# EAGLE design Aux Board V5 (EAGLE 9.2.0)
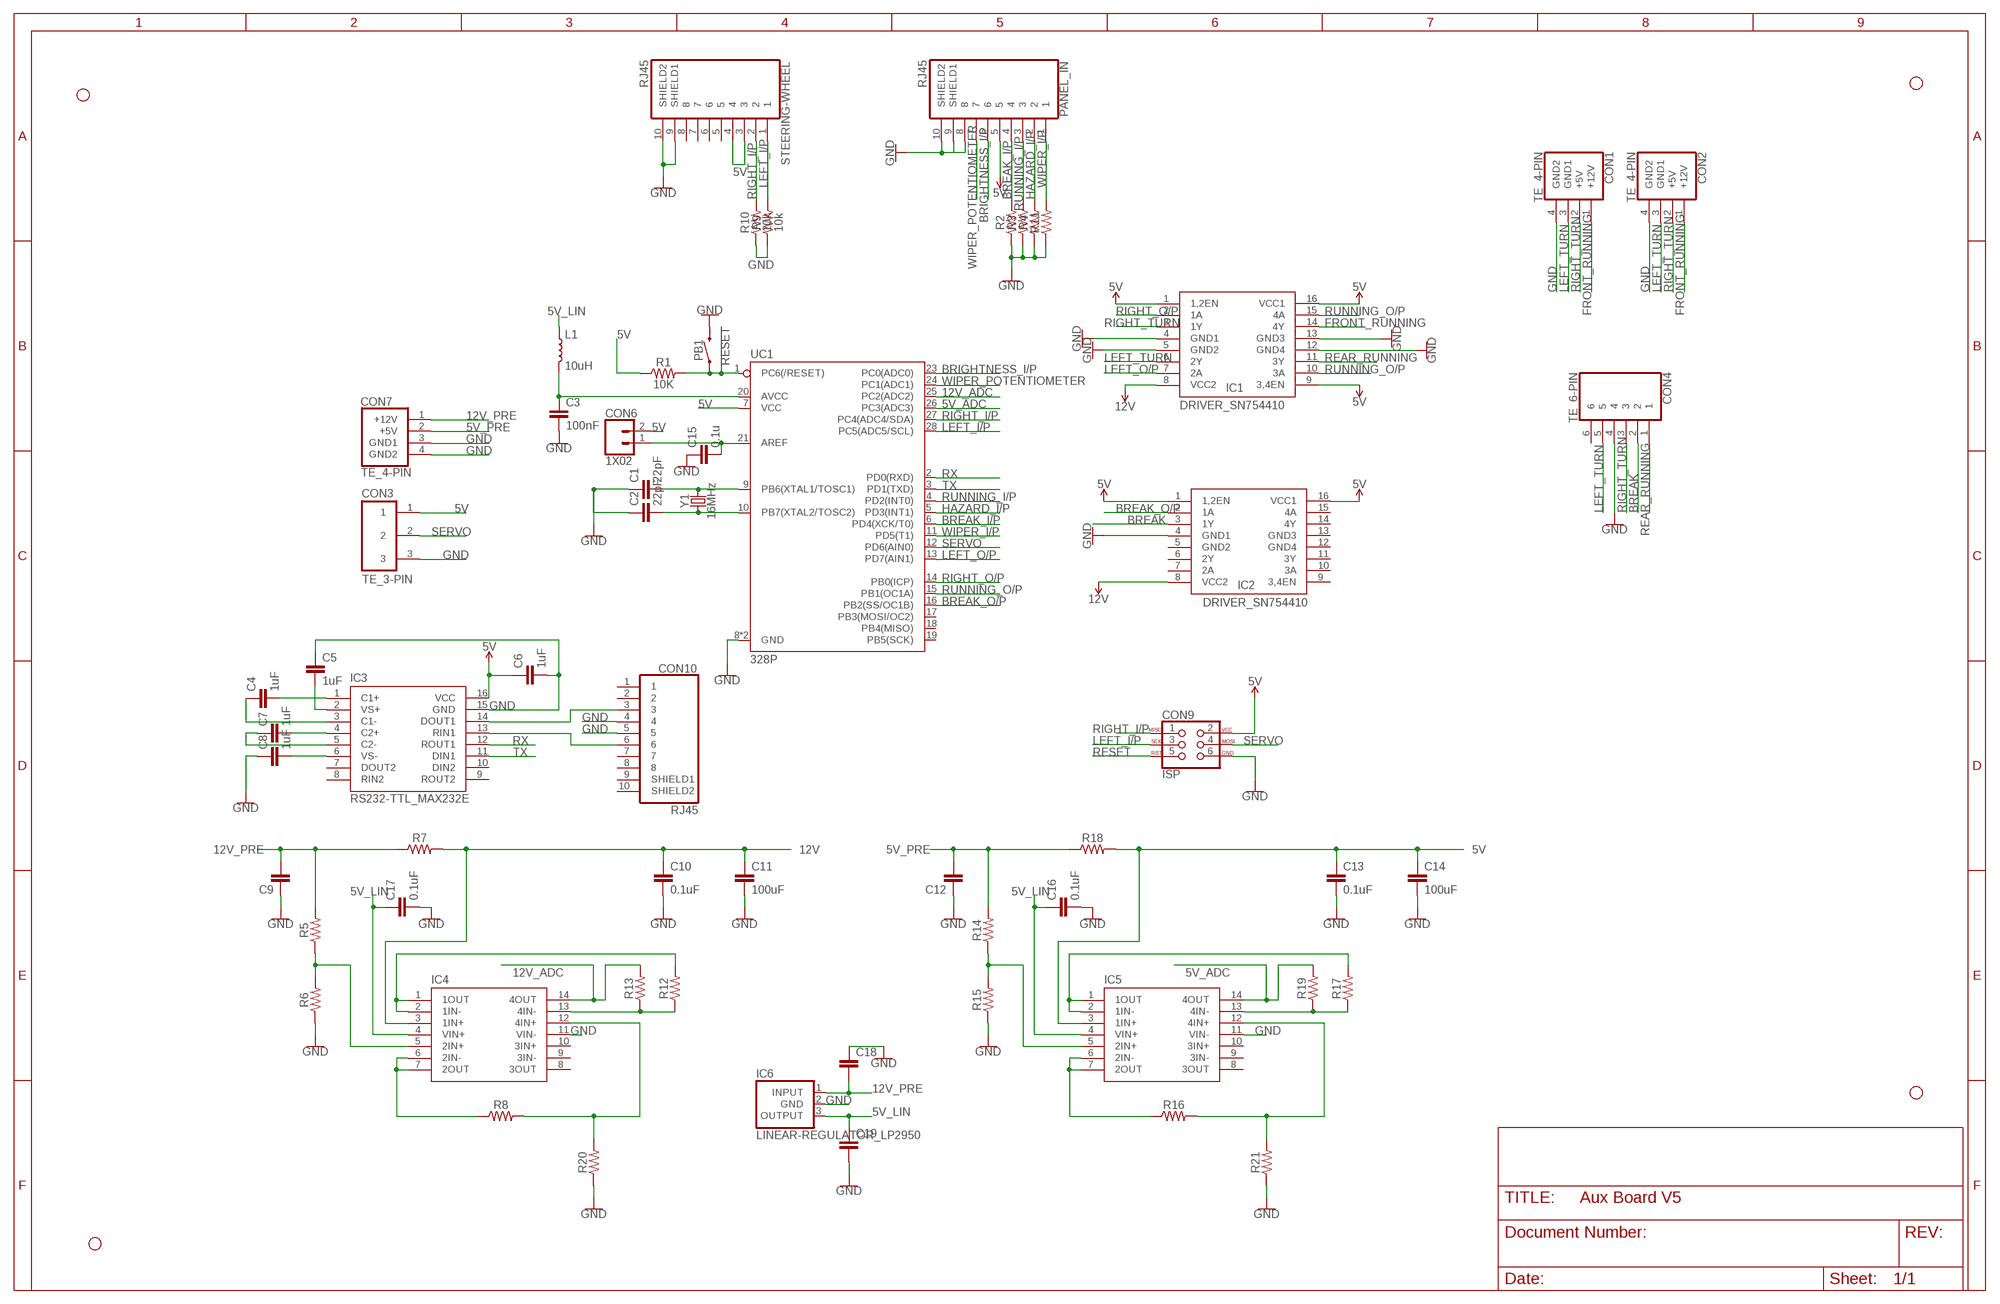
[diagram p0: schematic, sheet 1]

## Parts
C1  22pF  CAPACITOR_0805  [0805]
C2  22pF  CAPACITOR_0805  [0805]
C3  100nF  CAPACITOR_0805  [0805]
C4  1uF  CAPACITOR_0805  [0805]
C5  1uF  CAPACITOR_0805  [0805]
C6  1uF  CAPACITOR_0805  [0805]
C7  1uF  CAPACITOR_0805  [0805]
C8  1uF  CAPACITOR_0805  [0805]
C9  CAPACITOR_0805  [0805]
C10  0.1uF  CAPACITOR_0805  [0805]
C11  100uF  CAPACITOR_0805  [0805]
C12  CAPACITOR_0805  [0805]
C13  0.1uF  CAPACITOR_0805  [0805]
C14  100uF  CAPACITOR_0805  [0805]
C15  0.1u  CAPACITOR_0805  [0805]
C16  0.1uF  CAPACITOR_0805  [0805]
C17  0.1uF  CAPACITOR_0805  [0805]
C18  CAPACITOR_0805  [0805]
C19  CAPACITOR_0805  [0805]
CON1  TE_4-PIN  [TE_4-PIN]
CON2  TE_4-PIN  [TE_4-PIN]
CON3  TE_3-PIN  [TE_3-PIN]
CON4  TE_6-PIN  [TE_6-PIN]
CON6  1X02  [1X02]
CON7  TE_4-PIN  [TE_4-PIN]
CON9  ISP  [ISP_CONNECTOR]
CON10  RJ45  [RJ45]
H1  STAND-OFF  [STAND-OFF]
H2  STAND-OFF  [STAND-OFF]
H3  STAND-OFF  [STAND-OFF]
H4  STAND-OFF  [STAND-OFF]
IC1  DRIVER_SN754410  [DIP16]
IC2  DRIVER_SN754410  [DIP16]
IC3  RS232-TTL_MAX232E  [DIP16]
IC4  OP-AMP_QUAD  [DIP14]
IC5  OP-AMP_QUAD  [DIP14]
IC6  LINEAR-REGULATOR_LP2950  [TO92]
L1  10uH  INDUCTOR_0805  [0805]
PANEL_IN  RJ45  [RJ45]
PB1  PUSHBUTTON  [PUSHBUTTON]
R1  10K  RESISTOR_0805  [0805]
R2  RESISTOR_0805  [0805]
R3  RESISTOR_0805  [0805]
R4  RESISTOR_0805  [0805]
R5  RESISTOR_0805  [0805]
R6  RESISTOR_0805  [0805]
R7  RESISTOR_1210  [1210]
R8  RESISTOR_0805  [0805]
R9  10k  RESISTOR_0805  [0805]
R10  10k  RESISTOR_0805  [0805]
R11  RESISTOR_0805  [0805]
R12  RESISTOR_0805  [0805]
R13  RESISTOR_0805  [0805]
R14  RESISTOR_0805  [0805]
R15  RESISTOR_0805  [0805]
R16  RESISTOR_0805  [0805]
R17  RESISTOR_0805  [0805]
R18  RESISTOR_1210  [1210]
R19  RESISTOR_0805  [0805]
R20  RESISTOR_0805  [0805]
R21  RESISTOR_0805  [0805]
STEERING-WHEEL  RJ45  [RJ45]
UC1  328P  ATMEGA328P_DIP28  [DIP28]
Y1  16MHz  CRYSTAL-16MHZPTH-HC49US  [HC49US]

## Nets
5V: C6.1 C13.1 C14.1 C15.2 CON3.1 CON6.1 CON6.2 CON9.2 IC1.1(1,2EN) IC1.9(3,4EN) IC1.16(VCC1) IC2.1(1,2EN) IC2.16(VCC1) IC3.16(VCC) IC5.3(1IN+) PANEL_IN.5 R1.1 R18.2 STEERING-WHEEL.3 STEERING-WHEEL.4 UC1.7(VCC) UC1.21(AREF)
5V_ADC: IC5.14(4OUT) R19.2 UC1.26(PC3(ADC3))
5V_LIN: C16.1 C17.1 C19.1 IC4.4(VIN+) IC5.4(VIN+) IC6.3(OUTPUT) L1.1
5V_PRE: C12.2 CON7.2(+5V) R14.2 R18.1
12V: C10.1 C11.1 IC1.8(VCC2) IC2.8(VCC2) IC4.3(1IN+) R7.2
12V_ADC: IC4.14(4OUT) R13.2 UC1.25(PC2(ADC2))
12V_PRE: C9.2 C18.2 CON7.1(+12V) IC6.1(INPUT) R5.2 R7.1
BREAK: CON4.2 IC2.3(1Y)
BREAK_I/P: PANEL_IN.4 R2.2 UC1.6(PD4(XCK/T0))
BREAK_O/P: IC2.2(1A) UC1.16(PB2(SS/OC1B))
BRIGHTNESS_I/P: PANEL_IN.6 UC1.23(PC0(ADC0))
FRONT_RUNNING: CON1.1(+12V) CON2.1(+12V) IC1.14(4Y)
GND: C1.1 C2.1 C3.2 C5.1 C6.2 C8.1 C9.1 C10.2 C11.2 C12.1 C13.2 C14.2 C15.1 C16.2 C17.2 C18.1 C19.2 CON1.4(GND2) CON2.4(GND2) CON3.3 CON4.4 CON7.3(GND1) CON7.4(GND2) CON9.6 CON10.4 CON10.5 IC1.4(GND1) IC1.5(GND2) IC1.12(GND4) IC1.13(GND3) IC2.4(GND1) IC3.15(GND) IC4.11(VIN-) IC5.11(VIN-) IC6.2(GND) PANEL_IN.8 PANEL_IN.9(SHIELD1) PANEL_IN.10(SHIELD2) PB1.3 PB1.4 R2.1 R3.1 R4.1 R6.1 R9.1 R10.1 R11.1 R15.1 R20.1 R21.1 STEERING-WHEEL.9(SHIELD1) STEERING-WHEEL.10(SHIELD2) UC1.8(GND) UC1.22(GND)
HAZARD_I/P: PANEL_IN.2 R4.2 UC1.5(PD3(INT1))
LEFT_I/P: CON9.3 R9.2 STEERING-WHEEL.1 UC1.28(PC5(ADC5/SCL))
LEFT_O/P: IC1.7(2A) UC1.13(PD7(AIN1))
LEFT_TURN: CON1.3(GND1) CON2.3(GND1) CON4.5 IC1.6(2Y)
N$1: C4.2 IC3.1(C1+)
N$2: IC4.5(2IN+) R5.1 R6.2
N$3: C4.1 IC3.3(C1-)
N$4: C5.2 IC3.2(VS+)
N$5: IC4.6(2IN-) IC4.7(2OUT) R8.1
N$6: IC5.5(2IN+) R14.1 R15.2
N$7: IC4.1(1OUT) IC4.2(1IN-) R12.2
N$8: C1.2 UC1.9(PB6(XTAL1/TOSC1)) Y1.2
N$9: C2.2 UC1.10(PB7(XTAL2/TOSC2)) Y1.1
N$10: C7.2 IC3.4(C2+)
N$11: C7.1 IC3.5(C2-)
N$12: C8.2 IC3.6(VS-)
N$13: CON10.3 IC3.14(DOUT1)
N$14: CON10.6 IC3.13(RIN1)
N$15: IC4.13(4IN-) R12.1 R13.1
N$16: IC5.6(2IN-) IC5.7(2OUT) R16.1
N$17: IC5.1(1OUT) IC5.2(1IN-) R17.2
N$18: IC5.13(4IN-) R17.1 R19.1
N$19: C3.1 L1.2 UC1.20(AVCC)
N$20: IC4.12(4IN+) R8.2 R20.2
N$21: IC5.12(4IN+) R16.2 R21.2
REAR_RUNNING: CON4.1 IC1.11(3Y)
RESET: CON9.5 PB1.1 PB1.2 R1.2 UC1.1(PC6(/RESET))
RIGHT_I/P: CON9.1 R10.2 STEERING-WHEEL.2 UC1.27(PC4(ADC4/SDA))
RIGHT_O/P: IC1.2(1A) UC1.14(PB0(ICP))
RIGHT_TURN: CON1.2(+5V) CON2.2(+5V) CON4.3 IC1.3(1Y)
RUNNING_I/P: PANEL_IN.3 R3.2 UC1.4(PD2(INT0))
RUNNING_O/P: IC1.10(3A) IC1.15(4A) UC1.15(PB1(OC1A))
RX: IC3.12(ROUT1) UC1.2(PD0(RXD))
SERVO: CON3.2 CON9.4 UC1.12(PD6(AIN0))
TX: IC3.11(DIN1) UC1.3(PD1(TXD))
WIPER_I/P: PANEL_IN.1 R11.2 UC1.11(PD5(T1))
WIPER_POTENTIOMETER: PANEL_IN.7 UC1.24(PC1(ADC1))
Unconnected: CON4.6 CON10.1 CON10.2 CON10.7 CON10.8 CON10.9(SHIELD1) CON10.10(SHIELD2) IC2.5(GND2) IC2.6(2Y) IC2.7(2A) IC2.9(3,4EN) IC2.10(3A) IC2.11(3Y) IC2.12(GND4) IC2.13(GND3) IC2.14(4Y) IC2.15(4A) IC3.7(DOUT2) IC3.8(RIN2) IC3.9(ROUT2) IC3.10(DIN2) IC4.8(3OUT) IC4.9(3IN-) IC4.10(3IN+) IC5.8(3OUT) IC5.9(3IN-) IC5.10(3IN+) STEERING-WHEEL.5 STEERING-WHEEL.6 STEERING-WHEEL.7 STEERING-WHEEL.8 UC1.17(PB3(MOSI/OC2)) UC1.18(PB4(MISO)) UC1.19(PB5(SCK))

## Library data of the parts
C1-C19 = EcoCar-Passives:CAPACITOR_0805
CON1 CON2 CON7 = EcoCar-Connectors:TE_4-PIN: 4 Pin TE Mini-Universal MATE-N-LOK - Use for 12V and 5V connections Part Number: 1-770968-0 Digikey Part Number: A32474-ND Matching Plug: A25571-ND Matching Crimps: A100828CT-ND
CON3 = EcoCar-Connectors:TE_3-PIN: 3 Pin TE Mini-Universal MATE-N-LOK Part Number: 1-770967-0 Digikey Part Number: A32473-ND Matching Plug: A25588-ND Matching Crimps: A100828CT-ND
CON4 = EcoCar-Connectors:TE_6-PIN: 6 Pin TE Mini-Universal MATE-N-LOK Part Number: 1-770969-0 Digikey Part Number: A32475-ND Matching Plug: A97674-ND Matching Crimps: A100828CT-ND
CON6 = EcoCar-Connectors-2.54mm:1X02: 2.54mm (0.1") Header
CON9 = EcoCar-Microcontrollers:ISP: ISP Header Use for programming microcontrollers such as the 328P
CON10 PANEL_IN STEERING-WHEEL = EcoCar-Connectors:RJ45: RJ45 Connector - Use for signals and low power connections Unshielded Part Number: RJHSE-5080 Unshielded Digikey Part Number: RJHSE-5080-ND Shielded Part Number: RJHSE5E80 Shielded Digikey Part Number: RJHSE5E80-ND
H1-H4 = EcoCar-Miscellaneous:STAND-OFF: Stand Off Drill holes for mechanically mounting via screws, standoffs, etc. Note: Use the keepout ring to avoid running the screw head into surrounding components. Variant Overviews STAND-OFF - Mechanical footprint for a #4 phillips button head screw. STAND-OFF-TIGHT - Mechanical footprint for a #4 phillips button head screw, Example SparkFun Products Screw - Phillips Head (1/4", 4-40, 10 pack) <https://www.sparkfun.com/products/10453> (PRT-10453) Screw - Phillips Head (1/2", 4-40, 10 pack) <https://www.sparkfun.com/products/10452> (PRT-10452) Screw - Phillips Head (3/4", 4-40, 10 pack) <https://www.sparkfun.com/products/10451> (PRT-10451) Screw - Phillips Head (1", 4-40, 10 pack) <https://www.sparkfun.com/products/10450> (PRT-10450)
IC1 IC2 = EcoCar-Integrated-Circuits:DRIVER_SN754410: SN754410 Quadruple Half-H Driver Manufacturer: Texas Instruments Part Number: SN754410NE Digikey Part Number: 296-9911-5-ND
IC3 = EcoCar-Integrated-Circuits:RS232-TTL_MAX232E: Dual 5V TTL to RS-232 Converter Manufacturer: Texas Instruments Part Number: MAX232EIN Digikey Part Number: 296-27963-5-ND
IC4 IC5 = EcoCar-Integrated-Circuits:OP-AMP_QUAD: Quad Channel Op-Amp (Generic) Example Part: Manufacturer: Texas Instruments Part Number: TLV274IN Digikey Part Number: 296-14379-5-ND
IC6 = EcoCar-Integrated-Circuits:LINEAR-REGULATOR_LP2950: 5V Linear Regulator Manufacturer: Texas Instruments Part Number: LP2950-50LPRE3 Digikey Part Number: 296-20933-1-ND
L1 = EcoCar-Passives:INDUCTOR_0805
PB1 = EcoCar-Electromechanical:PUSHBUTTON: Pushbutton Manufacturer: TE Connectivity ALCOSWITCH Switches Part Number: 1825910-6 Digikey Part Number: 450-1650-ND
R1-R6 R8-R17 R19-R21 = EcoCar-Passives:RESISTOR_0805
R7 R18 = EcoCar-Passives:RESISTOR_1210
UC1 = EcoCar-Microcontrollers:ATMEGA328P_DIP28: ATmega328P Manufacturer: Microchip Part Number: ATMEGA328P-PU Digikey Part Number: ATMEGA328P-PU-ND; PROD_ID: IC-09136
Y1 = EcoCar-Microcontrollers:CRYSTAL-16MHZ: 16MHz Crystal Oscillator Manufacturer: TXC Part Number: 9B-16.000MBBK-B Digikey Part Number: 887-2015-ND; PROD_ID: XTAL-08181; SF_ID: COM-00536

## Board
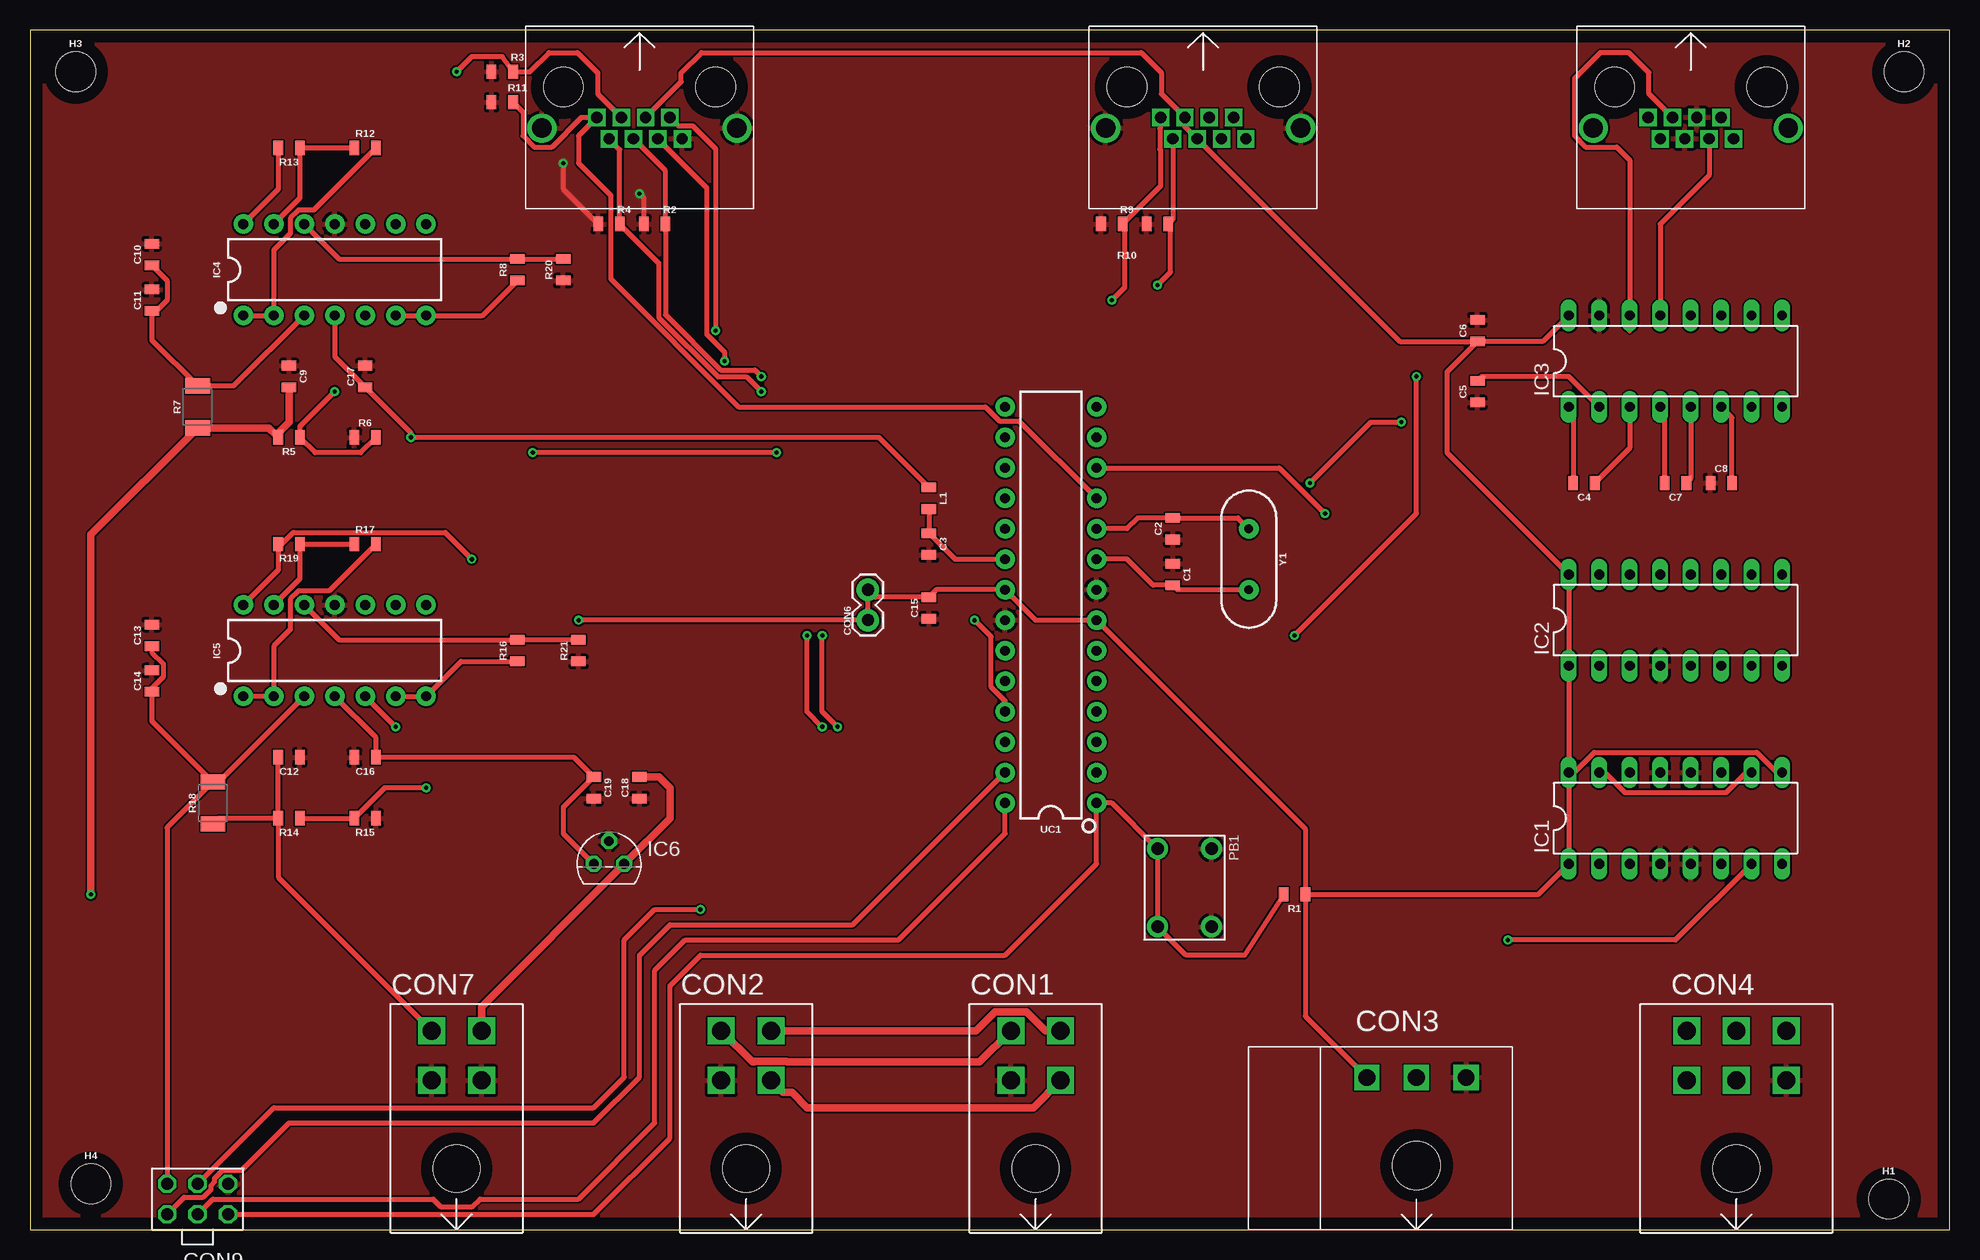
[diagram p1: board, top side]
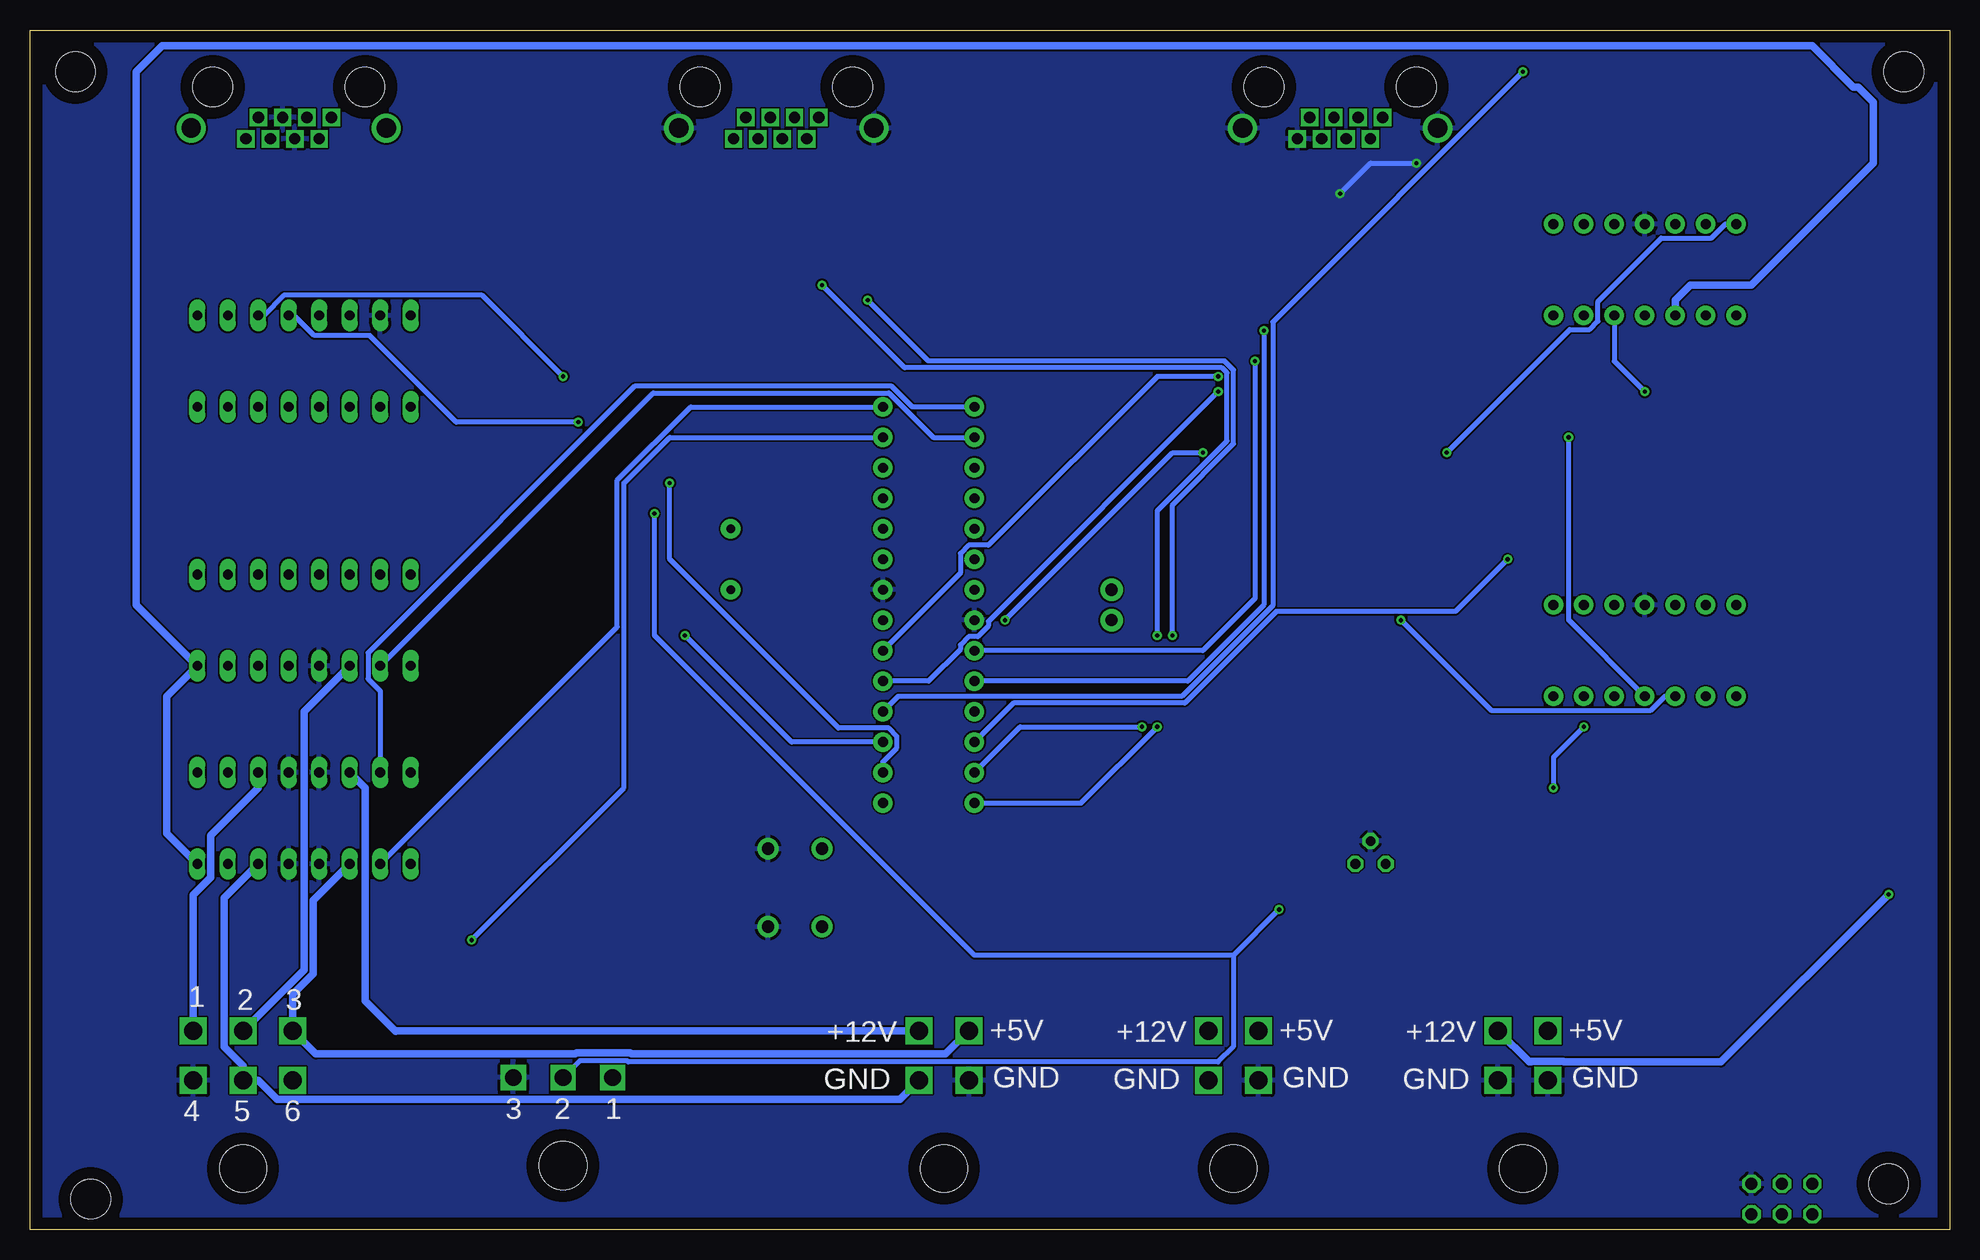
[diagram p2: board, bottom side, seen from below]

Size 160 x 100 mm. Coordinates in mm from the lower left corner, seen from the top.
Outline: 0,0 160,0 160,100 0,100 0,0
Copper layers (1*16): Top 0.035mm / dielectric 1.5mm / Bottom 0.035mm
Design rules "default": minimum track width 6mil, minimum drill 0.35mm, track to track 6mil, track to pad 6mil, pad to pad 6mil, via to via 6mil, smd to smd 6mil, copper to edge 40mil, drill to drill 6mil, minimum pad ring 10mil, minimum via ring 8mil, stop-mask expansion 4mil, vias tented up to drill 0mil, thermal gap 10mil

### Footprints (pad centres in the part's own frame; a part is rotated, then mirrored left to right if it is on the bottom)
0805 = smd 0.8 x 1.2: 1 -0.9,0; 2 0.9,0
TE_4-PIN = drill 1.5 square: 1 2.07,11.48; 2 -2.07,11.48; 3 2.07,7.34; 4 -2.07,7.34 | hole 3.91: 0,0
TE_3-PIN = drill 1.4 square: 1 -4.14,12.67; 2 0,12.67; 3 4.14,12.67 | hole 4: 0,5.33
TE_6-PIN = drill 1.5 square: 1 4.14,11.48; 2 0,11.48; 3 -4.14,11.48; 4 4.14,7.34; 5 0,7.34; 6 -4.14,7.34 | hole 3.91: 0,0
1X02 = drill 1.016 pad 1.88: 1 0,0; 2 2.54,0
ISP_CONNECTOR = drill 1.016 octagon: 1 2.54,1.27; 2 2.54,-1.27; 3 0,1.27; 4 0,-1.27; 5 -2.54,1.27; 6 -2.54,-1.27
RJ45 = drill 0.94 square: 1 9.9,2.54; 2 8.88,4.32; 3 7.87,2.54; 4 6.85,4.32; 5 5.84,2.54; 6 4.82,4.32; 7 3.81,2.54; 8 2.79,4.32 | drill 1.62: 9 -1.78,3.43; 10 14.48,3.43 | hole 3.3: 0,0; 12.7,0
STAND-OFF = hole 3.302: 0,0
DIP16 = drill 0.813 long: 1 -8.89,-3.81; 2 -6.35,-3.81; 3 -3.81,-3.81; 4 -1.27,-3.81; 5 1.27,-3.81; 6 3.81,-3.81; 7 6.35,-3.81; 8 8.89,-3.81; 9 8.89,3.81; 10 6.35,3.81; 11 3.81,3.81; 12 1.27,3.81; 13 -1.27,3.81; 14 -3.81,3.81; 15 -6.35,3.81; 16 -8.89,3.81
DIP14 = drill 0.813 pad 1.626: 1 -7.62,-3.81; 2 -5.08,-3.81; 3 -2.54,-3.81; 4 0,-3.81; 5 2.54,-3.81; 6 5.08,-3.81; 7 7.62,-3.81; 8 7.62,3.81; 9 5.08,3.81; 10 2.54,3.81; 11 0,3.81; 12 -2.54,3.81; 13 -5.08,3.81; 14 -7.62,3.81
TO92 = drill 0.813 octagon: 1 1.27,0; 2 0,1.905; 3 -1.27,0
PUSHBUTTON = drill 1.04 pad 1.778: 1 0,0; 2 6.5,0; 3 0,4.5; 4 6.5,4.5
1210 = smd 1.27 x 2.06: 1 -1.755,0; 2 1.755,0
DIP28 = drill 0.813 pad 1.626: 1 -16.51,-3.81; 2 -13.97,-3.81; 3 -11.43,-3.81; 4 -8.89,-3.81; 5 -6.35,-3.81; 6 -3.81,-3.81; 7 -1.27,-3.81; 8 1.27,-3.81; 9 3.81,-3.81; 10 6.35,-3.81; 11 8.89,-3.81; 12 11.43,-3.81; 13 13.97,-3.81; 14 16.51,-3.81; 15 16.51,3.81; 16 13.97,3.81; 17 11.43,3.81; 18 8.89,3.81; 19 6.35,3.81; 20 3.81,3.81; 21 1.27,3.81; 22 -1.27,3.81; 23 -3.81,3.81; 24 -6.35,3.81; 25 -8.89,3.81; 26 -11.43,3.81; 27 -13.97,3.81; 28 -16.51,3.81
HC49US = drill 0.7 pad 1.651: 1 -2.54,0; 2 2.54,0

### Placement (x,y rotation side)
C1  95.25,54.61 270 top
C2  95.25,58.42 90 top
C3  74.93,57.15 270 top
C4  129.54,62.23 180 top
C5  120.65,69.85 90 top
C6  120.65,74.93 90 top
C7  137.16,62.23 180 top
C8  140.97,62.23 0 top
C9  21.59,71.12 270 top
C10  10.16,81.28 90 top
C11  10.16,77.47 90 top
C12  21.59,39.37 180 top
C13  10.16,49.53 90 top
C14  10.16,45.72 90 top
C15  74.93,51.82 90 top
C16  27.94,39.37 180 top
C17  27.94,71.12 90 top
C18  50.8,36.83 90 top
C19  46.99,36.83 270 top
CON1  83.82,5.08 0 top
CON2  59.69,5.08 0 top
CON3  115.57,0 0 top
CON4  142.24,5.08 0 top
CON6  69.85,50.8 90 top
CON7  35.56,5.08 0 top
CON9  13.97,2.54 180 top
CON10  144.78,95.25 180 top
H1  154.94,2.54 0 top
H2  156.21,96.52 0 top
H3  3.81,96.52 0 top
H4  5.08,3.81 0 top
IC1  137.16,34.29 0 top
IC2  137.16,50.8 0 top
IC3  137.16,72.39 0 top
IC4  25.4,80.01 0 top
IC5  25.4,48.26 0 top
IC6  48.26,30.48 0 top
L1  74.93,60.96 270 top
PANEL_IN  57.15,95.25 180 top
PB1  93.98,31.75 270 top
R1  105.41,27.94 180 top
R2  52.07,83.82 0 top
R3  39.37,96.52 0 top
R4  48.26,83.82 0 top
R5  21.59,66.04 180 top
R6  27.94,66.04 0 top
R7  13.97,68.58 90 top
R8  40.64,80.01 90 top
R9  90.17,83.82 0 top
R10  93.98,83.82 0 top
R11  39.37,93.98 0 top
R12  27.94,90.17 0 top
R13  21.59,90.17 180 top
R14  21.59,34.29 180 top
R15  27.94,34.29 180 top
R16  40.64,48.26 90 top
R17  27.94,57.15 0 top
R18  15.24,35.56 90 top
R19  21.59,57.15 180 top
R20  44.45,80.01 90 top
R21  45.72,48.26 90 top
STEERING-WHEEL  104.14,95.25 180 top
UC1  85.09,52.07 90 top
Y1  101.6,55.88 270 top

### Tracks (layer width: path | path; a pad name or v marks a point on that pad's centre or on a via)
5V  (via drill 0.35)
  Top 0.406: IC3.16 126.1,74.03 C6.1 | C6.1 118.11,71.49 118.11,64.77 IC2.16 IC2.1 IC1.16 | C6.1 114.19,74.03 STEERING-WHEEL.4 96.27,91.95 STEERING-WHEEL.3 94.31,94.67 94.31,96.44 92.63,98.12 55.96,98.12 54.28,96.44 54.28,95.68 PANEL_IN.5 | 127,29.21 IC1.1 | R1.1 125.73,27.94 IC1.1 | R1.1 106.31,17.79 CON3.1 | R1.1 106.31,33.39 UC1.7 83.82,50.8 UC1.21 75.55,53.34 C15.2 70.47,52.72 CON6.2 CON6.1 v45.72,50.8 | IC1.16 IC1.1 | R18.2 10.16,42.4 C14.1 10.16,45.12 11.12,46.07 11.12,47.17 10.16,48.12 C13.1 | R18.2 11.43,33.51 CON9.2 | IC5.3 15.72,37.31 R18.2 | IC1.16 128.71,38.1 130.39,39.78 143.93,39.78 145.61,38.1 IC1.9
  Bottom 0.406: IC5.3 23.75,44.45 24.92,43.28 38.2,43.28 v45.72,50.8
5V_ADC  (via drill 0.35)
  Top 0.406: IC5.14 20.69,54.98 R19.2 20.99,57.15 21.94,58.11 34.6,58.11 v36.83,55.88
  Bottom 0.406: v36.83,55.88 41.18,51.53 56.11,51.53 63.75,43.89 78.03,43.89 UC1.26
5V_LIN  (via drill 0.35)
  Top 0.406: IC6.3 44.45,33.02 44.45,35.19 C19.1 45.35,39.37 C16.1 28.84,41.01 IC5.4 | IC4.4 25.4,72.76 C17.1 31.75,66.41 v31.75,66.04 70.75,66.04 L1.1
  Bottom 0.406: IC5.4 31.75,50.8 v31.75,66.04
5V_PRE
  Top 0.406: R14.2 C12.2 | R14.2 15.72,34.29 R18.1 | R14.2 20.69,29.36 CON7.2
12V
  Top 0.406: IC4.3 17,70.33 R7.2 10.16,74.14 10.16,76.2 | C11.1 10.16,76.2 | C10.1 11.43,79.11 11.43,77.47 10.16,76.2
  Bottom 0.61: IC1.8 148.59,33.02 148.59,44.45 IC2.8 151.13,52.07 151.13,96.52 148.97,98.68 11.43,98.68 8,95.25 7.62,95.25 6.35,93.98 6.35,88.9 16.51,78.74 21.59,78.74 22.86,77.47 IC4.3
12V_ADC  (via drill 0.35)
  Top 0.406: R13.2 20.69,86.73 IC4.14 | UC1.25 81.28,44.07 80.11,45.24 80.11,49.43 v78.74,50.8 | v62.23,64.77 v41.91,64.77
  Bottom 0.406: v78.74,50.8 64.77,64.77 v62.23,64.77 | v41.91,64.77 31.65,75.03 30,75.03 29.31,75.72 29.31,77.37 24.03,82.65 19.84,82.65 18.67,83.82 IC4.14
12V_PRE  (via drill 0.35)
  Top 0.61: CON7.1 37.63,18.58 IC6.1 53.34,34.29 53.34,36.83 52.44,37.73 C18.2 | 20.5,66.22 19.91,66.83 R7.1 5.08,57.94 v5.08,27.94 | 20.5,66.22 R5.2 | C9.2 21.59,67.31 20.5,66.22
  Bottom 0.61: v5.08,27.94 19.05,13.97 32.14,13.97 32.18,14 34.8,14 34.84,13.97 35.04,13.97 CON7.1
BREAK
  Bottom 0.61: CON4.2 137.16,21.64 137.16,43.18 IC2.3
BREAK_I/P  (via drill 0.35)
  Top 0.406: PANEL_IN.4 52.97,88.26 R2.2 52.97,76.27 57.58,71.66 60.42,71.66 v60.96,71.12
  Bottom 0.406: v60.96,71.12 66.04,71.12 80.11,57.05 81.76,57.05 82.45,56.36 82.45,54.71 UC1.6
BREAK_O/P
  Bottom 0.406: UC1.16 84.71,66.04 88.42,69.75 108.05,69.75 IC2.2
BRIGHTNESS_I/P  (via drill 0.35)
  Top 0.406: v57.88,72.39 57.88,73.16 56.42,74.63 56.42,86.84 PANEL_IN.6
  Bottom 0.406: v57.88,72.39 57.88,52.61 62.23,48.26 UC1.23
FRONT_RUNNING
  Top 0.61: CON2.1 78.85,16.56 80.44,18.14 83.06,18.14 84.65,16.56 CON1.1
  Bottom 0.61: CON1.1 129.49,16.56 129.54,16.51 132.08,19.05 132.08,36.83 IC1.14
GND  (via drill 0.35)
  Top 0.406: R2.1 51.17,85.99 v50.8,86.36 | v44.45,88.9 44.45,86.73 R4.1
  Bottom 0.406: v50.8,86.36 48.26,88.9 v44.45,88.9
  pour Top: 0,100.33 0,0 160.02,0 160.02,100.33
  pour Bottom: 0,100.33 0,0 160.02,0 160.02,100.33
HAZARD_I/P  (via drill 0.35)
  Top 0.406: PANEL_IN.2 49.16,90.04 R4.2 52.41,80.57 52.41,76.03 57.35,71.1 59.71,71.1 v60.96,69.85
  Bottom 0.406: UC1.5 85.09,45.72 82.45,48.36 82.45,48.74 81.76,49.43 81,49.43 80.11,50.32 80.11,50.7 v60.96,69.85
LEFT_I/P  (via drill 0.35)
  Top 0.406: 91.25,84 94.24,86.99 94.24,90 94.18,90.06 94.18,91.8 94.24,91.86 STEERING-WHEEL.1 | 91.25,84 R9.2 | CON9.3 15.24,2.54 33.61,2.54 34.24,1.91 36.88,1.91 37.51,2.54 45.72,2.54 52.07,8.89 52.07,21.59 54.61,24.13 72.39,24.13 81.28,33.02 UC1.28 | v66.04,41.91 64.77,43.18 v64.77,49.53 | v90.17,77.47 91.25,78.56 91.25,84
  Bottom 0.406: UC1.28 72.39,35.56 v66.04,41.91 | v90.17,77.47 85.11,72.41 60.42,72.41 59.67,71.66 59.67,65.5 64.77,60.4 v64.77,49.53
LEFT_O/P  (via drill 0.35)
  Top 0.406: IC1.7 137.16,24.13 v123.19,24.13
  Bottom 0.406: v123.19,24.13 110.49,36.83 110.49,62.23 106.68,66.04 UC1.13
LEFT_TURN
  Top 0.61: CON2.3 62.75,11.43 63.5,11.43 64.77,10.16 83.63,10.16 CON1.3
  Bottom 0.61: IC1.6 143.82,27.63 143.82,15.25 142.24,13.66 CON4.5 141,12.42 139.41,10.84 87.47,10.84 CON1.3
N$1
  Top 0.406: IC3.1 128.64,68.21 C4.2
N$2  (via drill 0.35)
  Top 0.406: R6.2 27.57,64.77 23.76,64.77 R5.1 22.49,66.94 v25.4,69.85
  Bottom 0.406: IC4.5 27.94,72.39 v25.4,69.85
N$3
  Top 0.406: IC3.3 133.35,65.14 C4.1
N$4
  Top 0.406: IC3.2 128.27,71.12 121.02,71.12 C5.2
N$5
  Top 0.406: IC4.6 IC4.7 37.73,76.2 R8.1
N$6  (via drill 0.35)
  Top 0.406: IC5.5 v30.48,41.91 | v33.02,36.83 29.58,36.83 R15.2 R14.1
  Bottom 0.406: v30.48,41.91 33.02,39.37 v33.02,36.83
N$7
  Top 0.406: IC4.1 IC4.2 20.32,81.65 21.69,83.02 21.69,84.3 22.38,84.99 23.66,84.99 R12.2
N$8
  Top 0.406: UC1.9 91.44,55.88 93.61,53.71 C1.2 95.62,53.34 Y1.2
N$9
  Top 0.406: UC1.10 91.44,58.42 92.34,59.32 C2.2 100.7,59.32 Y1.1
N$10
  Top 0.406: C7.2 136.26,68.21 IC3.4
N$11
  Top 0.406: IC3.5 138.43,62.6 C7.1
N$12
  Top 0.406: C8.2 141.87,67.68 IC3.6
N$13
  Top 0.406: CON10.3 134.95,94.67 134.95,96.44 133.27,98.12 130.89,98.12 128.73,95.96 128.73,91.17 129.65,90.25 132.25,90.25 133.35,89.15 IC3.14 133.35,74.93
N$14
  Top 0.406: CON10.6 139.96,87.89 135.89,83.82 IC3.13
N$15
  Top 0.406: IC4.13 22.49,85.99 R13.1 R12.1
N$16
  Top 0.406: R16.1 35.93,47.36 IC5.7 IC5.6
N$17
  Top 0.406: IC5.1 IC5.2 20.32,48.63 21.69,50 21.69,52.55 22.38,53.24 24.93,53.24 R17.2
N$18
  Top 0.406: IC5.13 22.49,54.24 R19.1 R17.1
N$19
  Top 0.406: L1.2 C3.1 77.1,55.88 UC1.20
N$20
  Top 0.406: IC4.12 25.77,80.91 R8.2 R20.2
N$21
  Top 0.406: R21.2 R16.2 25.77,49.16 IC5.12
REAR_RUNNING
  Bottom 0.61: CON4.1 146.38,27.91 144.93,29.36 144.93,32.87 140.97,36.83 IC1.11
RESET
  Top 0.406: R1.2 101.23,22.86 96.37,22.86 PB1.2 PB1.1 90.17,35.56 UC1.1 88.9,30.48 81.28,22.86 55.88,22.86 53.34,20.32 53.34,7.62 46.99,1.27 CON9.5
RIGHT_I/P  (via drill 0.35)
  Top 0.406: STEERING-WHEEL.2 95.26,84.2 95.06,84 | 95.06,84 R10.2 | CON9.1 12.85,2.69 14.43,2.69 15.09,3.35 15.09,3.66 15.39,3.96 15.39,4.27 16.05,4.93 17.63,4.93 21.59,8.89 46.99,8.89 50.8,12.7 50.8,22.86 53.34,25.4 68.58,25.4 UC1.27 | v67.31,41.91 66.04,43.18 v66.04,49.53 | v93.98,78.74 95.06,79.83 95.06,84
  Bottom 0.406: UC1.27 77.47,41.91 v67.31,41.91 | v93.98,78.74 87.09,71.85 60.66,71.85 60.23,71.42 60.23,65.74 66.04,59.92 v66.04,49.53
RIGHT_O/P
  Bottom 0.406: IC1.2 111.05,50.24 111.05,62.46 104.93,68.58 UC1.14
RIGHT_TURN
  Top 0.61: CON2.2 60.21,13.97 60.41,13.97 60.45,14 63.07,14 63.11,13.97 79.16,13.97 CON1.2
  Bottom 0.61: IC1.3 136.4,27.43 136.4,21.32 138.1,19.62 CON4.3 136.17,14.63 114.54,14.63 114.44,14.74 109.96,14.74 109.85,14.63 83.68,14.63 CON1.2
RUNNING_I/P  (via drill 0.35)
  Top 0.406: PANEL_IN.3 47.32,94.67 47.32,96.44 45.64,98.12 43.26,98.12 41.66,96.52 R3.2 39.37,97.79 36.83,97.79 v35.56,96.52
  Bottom 0.406: v35.56,96.52 56.42,75.66 56.42,52.01 63.98,44.45 87.63,44.45 UC1.4
RUNNING_O/P
  Top 0.406: IC1.15 131.25,38.1 132.93,36.42 141.39,36.42 143.07,38.1 IC1.10
  Bottom 0.406: UC1.15 86.46,68.58 88.19,70.31 109.59,70.31 131.83,48.07 131.83,45.91 130.81,44.89 IC1.15
RX  (via drill 0.35)
  Top 0.406: v106.68,62.23 111.76,67.31 v114.3,67.31
  Bottom 0.406: v106.68,62.23 106.68,55.88 92.61,41.81 88.42,41.81 87.73,41.12 87.73,40.16 88.9,38.99 UC1.2 | v114.3,67.31 124.46,67.31 131.67,74.52 136.31,74.52 137.99,76.2 IC3.12
SERVO  (via drill 0.35)
  Top 0.406: UC1.12 104.14,63.5 v107.95,59.69 | CON9.4 20.32,10.16 46.99,10.16 49.53,12.7 49.53,24.13 52.07,26.67 v55.88,26.67
  Bottom 0.406: v55.88,26.67 59.69,22.86 | 59.69,22.86 59.69,15.24 60.96,13.97 110.13,13.97 110.23,14.08 114.16,14.08 CON3.2 | 59.69,22.86 81.28,22.86 107.95,49.53 v107.95,59.69
TX  (via drill 0.35)
  Top 0.406: v105.41,49.53 115.57,59.69 v115.57,71.12
  Bottom 0.406: UC1.3 96.52,40.64 v105.41,49.53 | IC3.11 140.53,76.2 138.85,77.88 122.33,77.88 v115.57,71.12
WIPER_I/P
  Top 0.406: R11.2 41.1,93.15 41.1,91.17 42.02,90.25 43.51,90.25 45.97,92.71 PANEL_IN.1 45.72,91.18 45.72,88.9 48.4,86.22 48.4,79.25 59.08,68.58 79.63,68.58 80.8,67.41 82.45,67.41 UC1.11
WIPER_POTENTIOMETER  (via drill 0.35)
  Top 0.406: PANEL_IN.7 54.04,92.01 55.23,92.01 57.15,90.09 v57.15,74.93
  Bottom 0.406: v57.15,74.93 57.15,52.07 63.5,45.72 UC1.24